# Altium schematic sheet EPS_5V_EMI-Filter_In.SchDoc: 5V / EMI-Filter / In
size A4; SheetNumber: 44; SheetTotal: 51
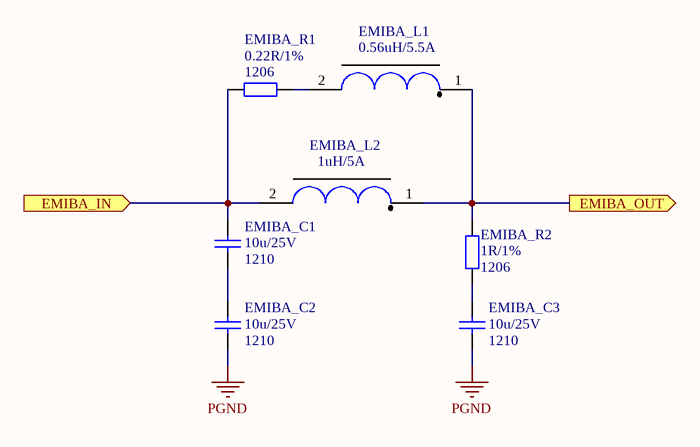
[diagram p0: EPS_5V_EMI-Filter_In.SchDoc]

## Parts
EMIBA_C1  Package: 1210  [SMD_Capacitor_1210]  (hidden comment: 10u/25V)
EMIBA_C2  Package: 1210  [SMD_Capacitor_1210]  (hidden comment: 10u/25V)
EMIBA_C3  Package: 1210  [SMD_Capacitor_1210]  (hidden comment: 10u/25V)
EMIBA_L1  0.56uH/5.5A  [Vishay_IHLP1212]
EMIBA_L2  1uH/5A  [Vishay_IHLP1212]
EMIBA_R1  Package: 1206  [SMD_Resistor_1206]  (hidden comment: 0.22R/1%)
EMIBA_R2  Package: 1206  [SMD_Resistor_1206]  (hidden comment: 1R/1%)

## Ports
EMIBA_IN (in), EMIBA_OUT (out)

## Nets
PGND: EMIBA_C2.2 EMIBA_C3.2
EMIBA_IN: EMIBA_C1.1 EMIBA_L2.2 EMIBA_R1.1 ; port EMIBA_IN
EMIBA_OUT: EMIBA_L1.1 EMIBA_L2.1 EMIBA_R2.2 ; port EMIBA_OUT
NetEMIBA_C1_2: EMIBA_C1.2 EMIBA_C2.1
NetEMIBA_C3_1: EMIBA_C3.1 EMIBA_R2.1
NetEMIBA_L1_2: EMIBA_L1.2 EMIBA_R1.2

## Notes on the sheet
- Title:
- Project:
- Author:
- Model:
- Document Number:
- Checked by:
- Rev:
- Date:
- Approved by:
- Sheet:
- of
- File name:

## Library data of the parts
EMIBA_C1-EMIBA_C3 = Cer_GCJ32ER71E106KA12L: Ceramic Cap Murata Automotive 10u/25V X7R 1210; Manufacturer: Murata; ManufacturerPartNumber: GCJ32ER71E106KA12L; Value: 10u/25V
EMIBA_L1 = IHLP1212BZERR56M11: Vishay IHLP1212 Inductor, L=0.56uH, Irise40deg=5.5A, ESR=16mR, SRF=1MHz.; Manufacturer: Vishay; ManufacturerPartNumber: IHLP1212BZERR56M11; Value: 0.56uH/5.5A
EMIBA_L2 = IHLP1212BZER1R0M11: Vishay IHLP1212 Inductor, L=1uH, Irise40deg=5A, ESR=20mR, SRF=1MHz.; Manufacturer: Vishay; ManufacturerPartNumber: IHLP1212BZER1R0M11; Value: 1uH/5A
EMIBA_R1 = ERJ-8BQFR22V: Panasonic Resistor 0.22R 1% 1206 330mW; Manufacturer: Panasonic; ManufacturerPartNumber: ERJ-8BQFR22V; Value: 0.22R/1%
EMIBA_R2 = ERJ-8BQF1R0V: Panasonic Resistor 1R 1% 1206 330mW; ManufacturerPartNumber: ERJ-8BQF1R0V; Manufacturer: Panasonic; Value: 1R/1%